# Altium schematic sheet USB-PS2_1.SchDoc
size 145 x 114 mm
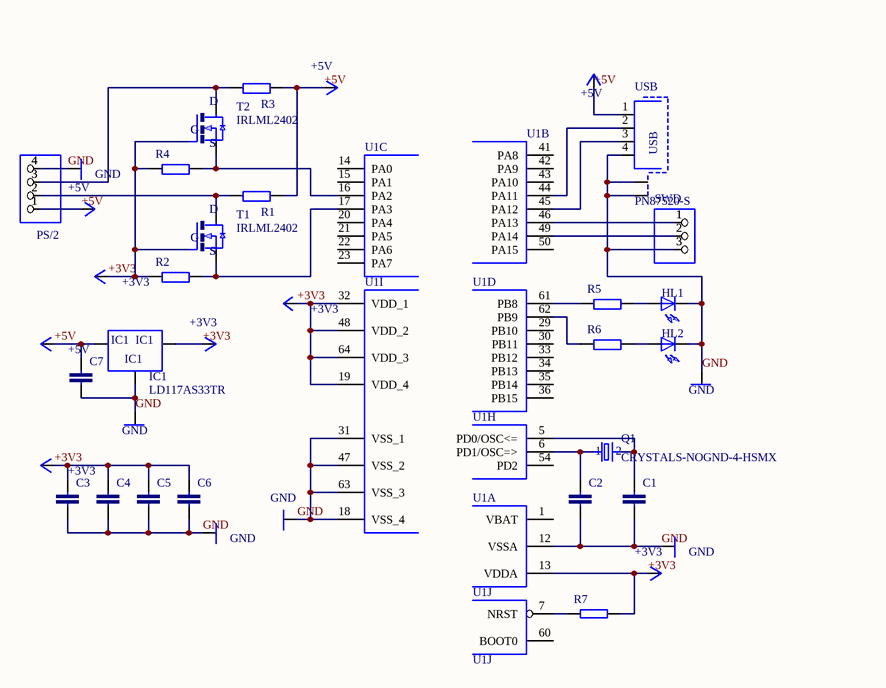
[diagram p0: USB-PS2_1.SchDoc]

## Parts
+3V1  +3V3
+3V2  +3V3
+3V3  +3V3
+3V4  +3V3
+3V5  +3V3
C1  (no value)  [C0603K]
C2  (no value)  [C0603K]
C3  (no value)  [C0603K]
C4  (no value)  [C0603K]
C5  (no value)  [C0603K]
C6  (no value)  [C0603K]
C7  (no value)  [C0603K]
GND1  GND
GND3  GND
GND4  GND
GND5  GND
GND6  GND
GND7  GND
HL1  (no value)  [SML0805]
HL2  (no value)  [SML0805]
IC1  LD117AS33TR  [SOT223]
P+1  +5V
P+2  +5V
P+3  +5V
P+4  +5V
PS/2  (no value)  [1X04]
Q1  CRYSTALS-NOGND-4-HSMX  [HC49-4-HSMX]
R1  (no value)  [R0603]
R2  (no value)  [R0603]
R3  (no value)  [R0603]
R4  (no value)  [R0603]
R5  (no value)  [R0603]
R6  (no value)  [R0603]
R7  (no value)  [R0603]
SWD  (no value)  [1X03]
T1  IRLML2402  [MICRO3]
T2  IRLML2402  [MICRO3]
U1  (no value)  [TQFP64]  (parts A,B,C,D,H,I,J of 10)
USB  PN87520-S  [PN87520-S]

## Nets
+3V3: +3V1.0(+3V3) +3V2.0(+3V3) +3V3.0(+3V3) +3V4.0(+3V3) +3V5.0(+3V3) C3.1 C4.1 C5.1 C6.1 IC1.4(OUT) R2.1 R4.1 R7.2 T1.1(G) T2.1(G) U1.13(VDDA) U1.19(VDD_4) U1.32(VDD_1) U1.48(VDD_2) U1.64(VDD_3)
+5V: C7.1 IC1.3(IN) P+1.0(+5V) P+2.0(+5V) P+3.0(+5V) P+4.0(+5V) PS/2.1 R1.1 R3.1 USB.1
GND: C1.2 C2.2 C3.2 C4.2 C5.2 C6.2 C7.2 GND1.0(GND) GND3.0(GND) GND4.0(GND) GND5.0(GND) GND6.0(GND) GND7.0(GND) HL1.C HL2.C IC1.1(ADJ) PS/2.4 SWD.3 U1.12(VSSA) U1.18(VSS_4) U1.31(VSS_1) U1.47(VSS_2) U1.63(VSS_3) USB.4 USB.S1 USB.S2
NetC1_1: C1.1 Q1.2 U1.5(PD0/OSC<=)
NetC2_1: C2.1 Q1.1 U1.6(PD1/OSC=>)
NetHL1_A: HL1.A R5.2
NetHL2_A: HL2.A R6.2
NetPS/2_2: PS/2.2 R1.2 T1.3(D)
NetPS/2_3: PS/2.3 R3.2 T2.3(D)
NetR2_2: R2.2 T1.2(S) U1.17(PA3)
NetR4_2: R4.2 T2.2(S) U1.16(PA2)
NetR5_1: R5.1 U1.61(PB8)
NetR6_1: R6.1 U1.62(PB9)
NetR7_1: R7.1 U1.7(NRST)
NetSWD_1: SWD.1 U1.46(PA13)
NetSWD_2: SWD.2 U1.49(PA14)
NetU1_44: U1.44(PA11) USB.2
NetU1_45: U1.45(PA12) USB.3

Not connected (* = marked no-connect by the designer): U1 1(VBAT) 14(PA0) 15(PA1) 20(PA4) 21(PA5) 22(PA6) 23(PA7) 29(PB10) 30(PB11) 33(PB12) 34(PB13) 35(PB14) 36(PB15) 41(PA8) 42(PA9) 43(PA10) 50(PA15) 54(PD2) 60(BOOT0)

## Library data of the parts
C1-C7 = C-EUC0603K
HL1 HL2 = LEDSML0805
PS/2 = PINHD-1X4
R1-R7 = R-EU_R0603
SWD = PINHD-1X3
U1 = STM32F10XRXT6